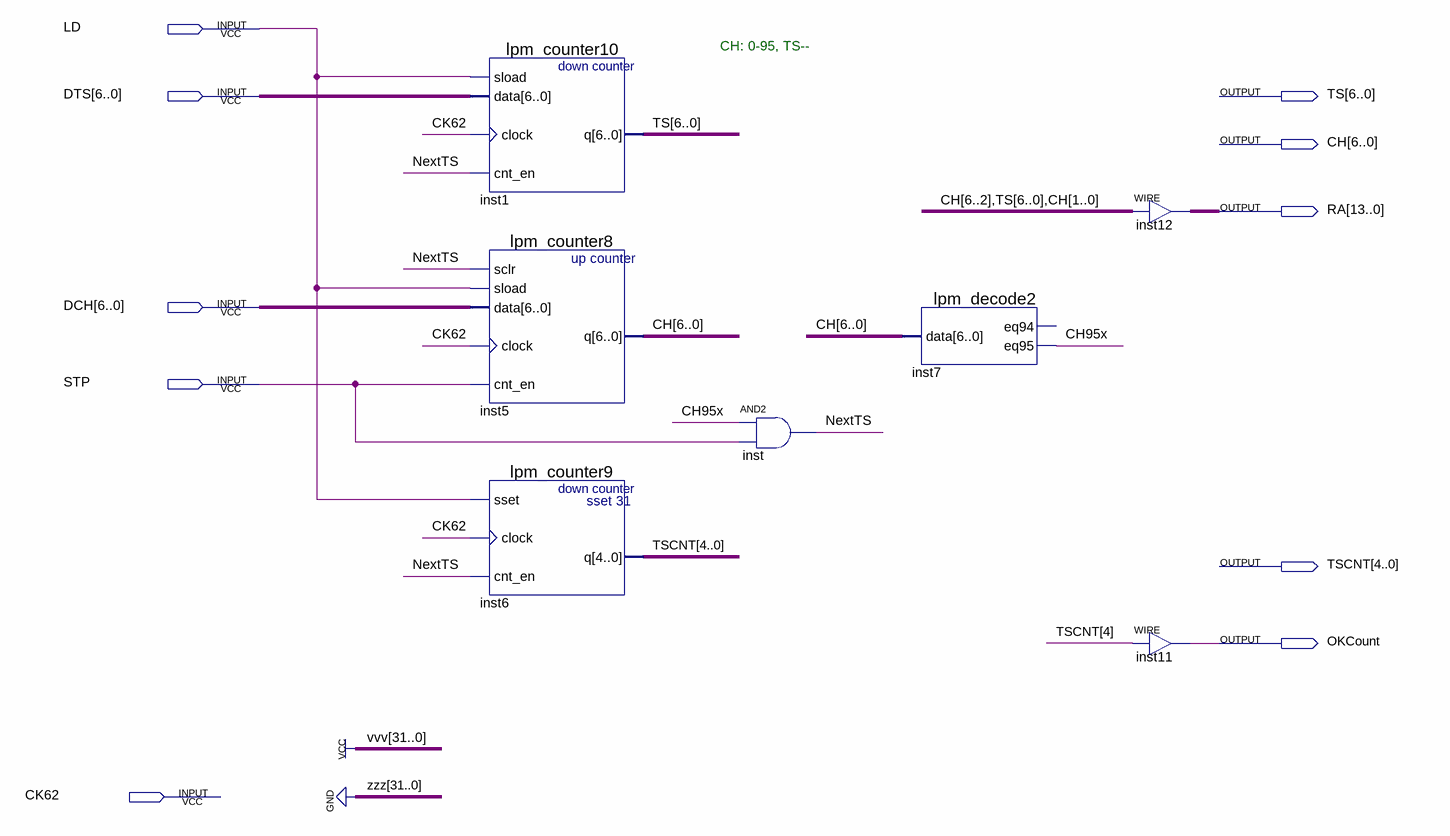
[diagram p0: schematic sheet]
// Quartus schematic ChTSCount3.bdf as structural Verilog: 7 symbols, 10 pins
module ChTSCount3 (
  input  LD,
  input  [6:0] DTS,
  input  [6:0] DCH,
  input  STP,
  input  CK62,
  output [6:0] TS,
  output [6:0] CH,
  output [13:0] RA,
  output [4:0] TSCNT,
  output OKCount
);

  wire CH95x, NextTS;

  lpm_counter10 inst1 (.sload(LD), .data(DTS), .clock(CK62), .cnt_en(NextTS), .q(TS));
  lpm_counter8 inst5 (.sclr(NextTS), .sload(LD), .data(DCH), .clock(CK62), .cnt_en(STP), .q(CH));
  lpm_counter9 inst6 (.sset(LD), .clock(CK62), .cnt_en(NextTS), .q(TSCNT));
  and inst (NextTS, CH95x, STP);
  lpm_decode2 inst7 (.data(CH), .eq95(CH95x));  // open: eq94
  assign RA = {CH[6:2], TS, CH[1:0]};  // WIRE inst12
  assign OKCount = TSCNT[4];  // WIRE inst11

  // Notes on the sheet:
  //   CH: 0-95, TS--
endmodule
